# EAGLE schematic version1 (EAGLE 9.5.1)
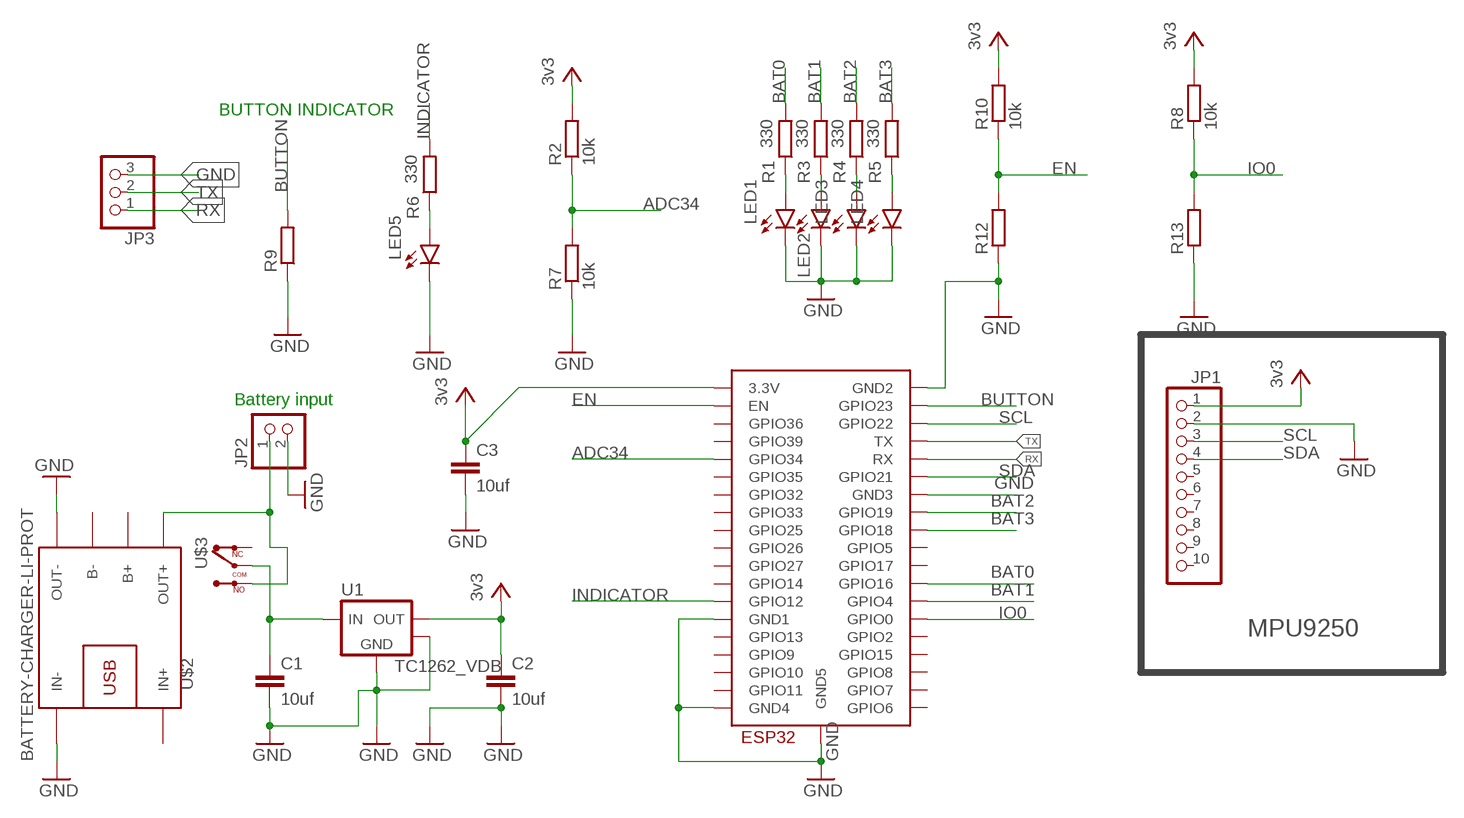
[diagram p0: schematic, sheet 1]

## Parts
C1  10uf  C-EUC0805  [C0805]
C2  10uf  C-EUC0805  [C0805]
C3  10uf  C-EUC0805  [C0805]
JP1  PINHD-1X10_2.54-SMD-90°  [1X10SMD/90]
JP2  PINHD-1X2  [1X02]
JP3  PINHD-1X3  [1X03]
LED1  LEDSML0805  [SML0805]
LED2  LEDSML0805  [SML0805]
LED3  LEDSML0805  [SML0805]
LED4  LEDSML0805  [SML0805]
LED5  LEDSML0805  [SML0805]
R1  330  R-EU_R0805  [R0805]
R2  10k  R-EU_R0805  [R0805]
R3  330  R-EU_R0805  [R0805]
R4  330  R-EU_R0805  [R0805]
R5  330  R-EU_R0805  [R0805]
R6  330  R-EU_R0805  [R0805]
R7  10k  R-EU_R0805  [R0805]
R8  10k  R-EU_R0805  [R0805]
R9  R-EU_M2309  [M2309]
R10  10k  R-EU_R0805  [R0805]
R12  R-EU_M2309  [M2309]
R13  R-EU_M2309  [M2309]
U1  TC1262_VDB  [SOT-223-3]
U$1  ESP32-WROOM  [ESP32-WROOM]
U$2  BATTERY-CHARGER-LI-PROT  [BATTERY-CHARGER-LI-PROT]
U$3  -MICROSW  [CON3]

## Nets
ADC34: R2.1 R7.2 U$1.IO34(GPIO34)
BAT0: R1.2 U$1.IO16(GPIO16)
BAT1: R3.2 U$1.IO4(GPIO4)
BAT2: R4.2 U$1.IO19(GPIO19)
BAT3: R5.2 U$1.IO18(GPIO18)
BUTTON: R9.2 U$1.IO23(GPIO23)
EN: R10.1 R12.2 U$1.EN
GND: C1.2 C2.2 C3.2 JP1.2 JP2.2 JP3.3 LED1.C LED2.C LED3.C LED4.C LED5.C R7.1 R9.1 R12.1 R13.1 U1.2(GND) U1.4(TAB) U$1.GND1 U$1.GND2 U$1.GND3 U$1.GND4 U$1.GND5 U$2.IN- U$2.OUT-
INDICATOR: R6.2 U$1.IO12(GPIO12)
IO0: R8.1 R13.2 U$1.IO0(GPIO0)
N$1: LED5.A R6.1
N$2: JP2.1 U$2.OUT+ U$3.P$1
N$3: LED1.A R1.1
N$4: LED2.A R3.1
N$5: LED3.A R4.1
N$6: LED4.A R5.1
N$7: C1.1 U1.1(VIN) U$3.P$2
RX: JP3.1 U$1.RX
SCL: JP1.3 U$1.IO22(GPIO22)
SDA: JP1.4 U$1.IO21(GPIO21)
TX: JP3.2 U$1.TX
VCC: C2.1 C3.1 JP1.1 R2.2 R8.2 R10.2 U1.3(VOUT) U$1.3V3(3.3V) ; supply symbol labelled 3v3
Unconnected: JP1.5 JP1.6 JP1.7 JP1.8 JP1.9 JP1.10 U$1.CLK(GPIO6) U$1.CMD(GPIO11) U$1.IO2(GPIO2) U$1.IO5(GPIO5) U$1.IO13(GPIO13) U$1.IO14(GPIO14) U$1.IO15(GPIO15) U$1.IO17(GPIO17) U$1.IO25(GPIO25) U$1.IO26(GPIO26) U$1.IO27(GPIO27) U$1.IO32(GPIO32) U$1.IO33(GPIO33) U$1.IO35(GPIO35) U$1.SD0(GPIO7) U$1.SD1(GPIO8) U$1.SD2(GPIO9) U$1.SD3(GPIO10) U$1.SENSOR_VN(GPIO39) U$1.SENSOR_VP(GPIO36) U$2.B+ U$2.B- U$2.IN+ U$3.P$3

## Notes on the sheet
- BUTTON INDICATOR
- Battery input
- MPU9250

## Library data of the parts
C1-C3 = rcl:C-EU: CAPACITOR, European symbol; SPICEPREFIX: C
JP1 = pinhead-2:PINHD-1X10: PIN HEADER
JP2 = pinhead:PINHD-1X2: PIN HEADER
JP3 = pinhead:PINHD-1X3: PIN HEADER
LED1-LED5 = led:LED: LED OSRAM: - CHIPLED LG R971, LG N971, LY N971, LG Q971, LY Q971, LO R971, LY R971 LH N974, LH R974 LS Q976, LO Q976, LY Q976 LO Q996 - Hyper CHIPLED LW Q18S LB Q993, LB Q99A, LB R99A - SideLED LS A670, LO A670, LY A670, LG A670, LP A670 LB A673, LV A673, LT A673, LW A673 LH A674 LY A675 LS A676, LA A676, LO A676, LY A676, LW A676 LS A679, LY A679, LG A679 - Hyper Micro SIDELED® LS Y876, LA Y876, LO Y876, LY Y876 LT Y87S - SmartLED LW L88C, LW L88S LB L89C, LB L89S, LG L890 LS L89K, LO L89K, LY L89K LS L896, LA L896, LO L896, LY L896 - TOPLED LS T670, LO T670, LY T670, LG T670, LP T670 LSG T670, LSP T670, LSY T670, LOP T670, LYG T670 LG T671, LOG T671, LSG T671 LB T673, LV T673, LT T673, LW T673 LH T674 LS T676, LA T676, LO T676, LY T676, LB T676, LH T676, LSB T676, LW T676 LB T67C, LV T67C, LT T67C, LS T67K, LO T67K, LY T67K, LW E67C LS E67B, LA E67B, LO E67B, LY E67B, LB E67C, LV E67C, LT E67C LW T67C LS T679, LY T679, LG T679 LS T770, LO T770, LY T770, LG T770, LP T770 LB T773, LV T773, LT T773, LW T773 LH T774 LS E675, LA E675, LY E675, LS T675 LS T776, LA T776, LO T776, LY T776, LB T776 LHGB T686 LT T68C, LB T68C - Hyper Mini TOPLED® LB M676 - Mini TOPLED Santana® LG M470 LS M47K, LO M47K, LY M47K Source: http://www.osram.convergy.de LUXEON: - LUMILED® LXK2-PW12-R00, LXK2-PW12-S00, LXK2-PW14-U00, LXK2-PW14-V00 LXK2-PM12-R00, LXK2-PM12-S00, LXK2-PM14-U00 LXK2-PE12-Q00, LXK2-PE12-R00, LXK2-PE12-S00, LXK2-PE14-T00, LXK2-PE14-U00 LXK2-PB12-K00, LXK2-PB12-L00, LXK2-PB12-M00, LXK2-PB14-N00, LXK2-PB14-P00, LXK2-PB14-Q00 LXK2-PR12-L00, LXK2-PR12-M00, LXK2-PR14-Q00, LXK2-PR14-R00 LXK2-PD12-Q00, LXK2-PD12-R00, LXK2-PD12-S00 LXK2-PH12-R00, LXK2-PH12-S00 LXK2-PL12-P00, LXK2-PL12-Q00, LXK2-PL12-R00 Source: www.luxeon.com KINGBRIGHT: KA-3528ASYC Source: www.kingbright.com
R1-R10 R12 R13 = rcl:R-EU_: RESISTOR, European symbol; SPICEPREFIX: R
U1 = bt_regulator:TC1262: Microchip TC1262 LDO Regulator The TC1262 is a fixed output, high accuracy (typically ±0.5%) CMOS low dropout regulator. Designed specif- ically for battery-operated systems, the TC1262’s CMOS construction eliminates wasted ground current, significantly extending battery life. Total supply current is typically 80A at full load (20 to 60 times lower than in bipolar regulators). TC1262 key features include ultra low noise operation, very low dropout voltage (typically 350mV at full load), and fast response to step changes in load. Datasheet.pdf <http://ww1.microchip.com/downloads/en/DeviceDoc/21373C.pdf>
U$1 = ESP32:ESP32-WROOM
U$2 = diy-modules:BATTERY-CHARGER-LI-PROT: Lithium Battery 5V Charger with protection circuit More details available here: http://www.instructables.com/id/DIY-Lithium-ion-Battery-Charger/step4/TP4056-based-lithium-ion-battery-charger-module/ Click here to find device on ebay.com <http://www.ebay.com/sch/tp4056+charger+usb+protection>
U$3 = tango:-MICROSW

## Net classes
0 default: width 0.01 mm